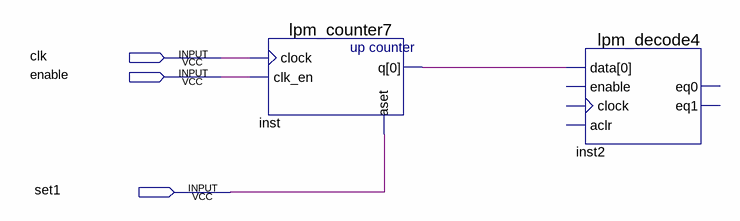
[diagram p0: schematic sheet]
// Quartus schematic TestFile.bdf as structural Verilog: 2 symbols, 3 pins
module TestFile (
  input  clk,
  input  enable,
  input  set1
);

  wire inst_q;

  lpm_counter7 inst (.clock(clk), .clk_en(enable), .aset(set1), .q(inst_q));
  lpm_decode4 inst2 (.data(inst_q));  // open: enable, clock, aclr, eq0, eq1
endmodule
